# Altium schematic sheet PCB_control_swarm_robotics_schematic.SchDoc: Falda de sensores ultrasónicos
size Letter; Date: julio-2017; Author: William Abel Orozco Cifuentes; DrawnBy: William Abel Orozco Cifuentes; Organization: Universidad Del Valle De Guatemala; Curso: Proyecto 3 de electrónica
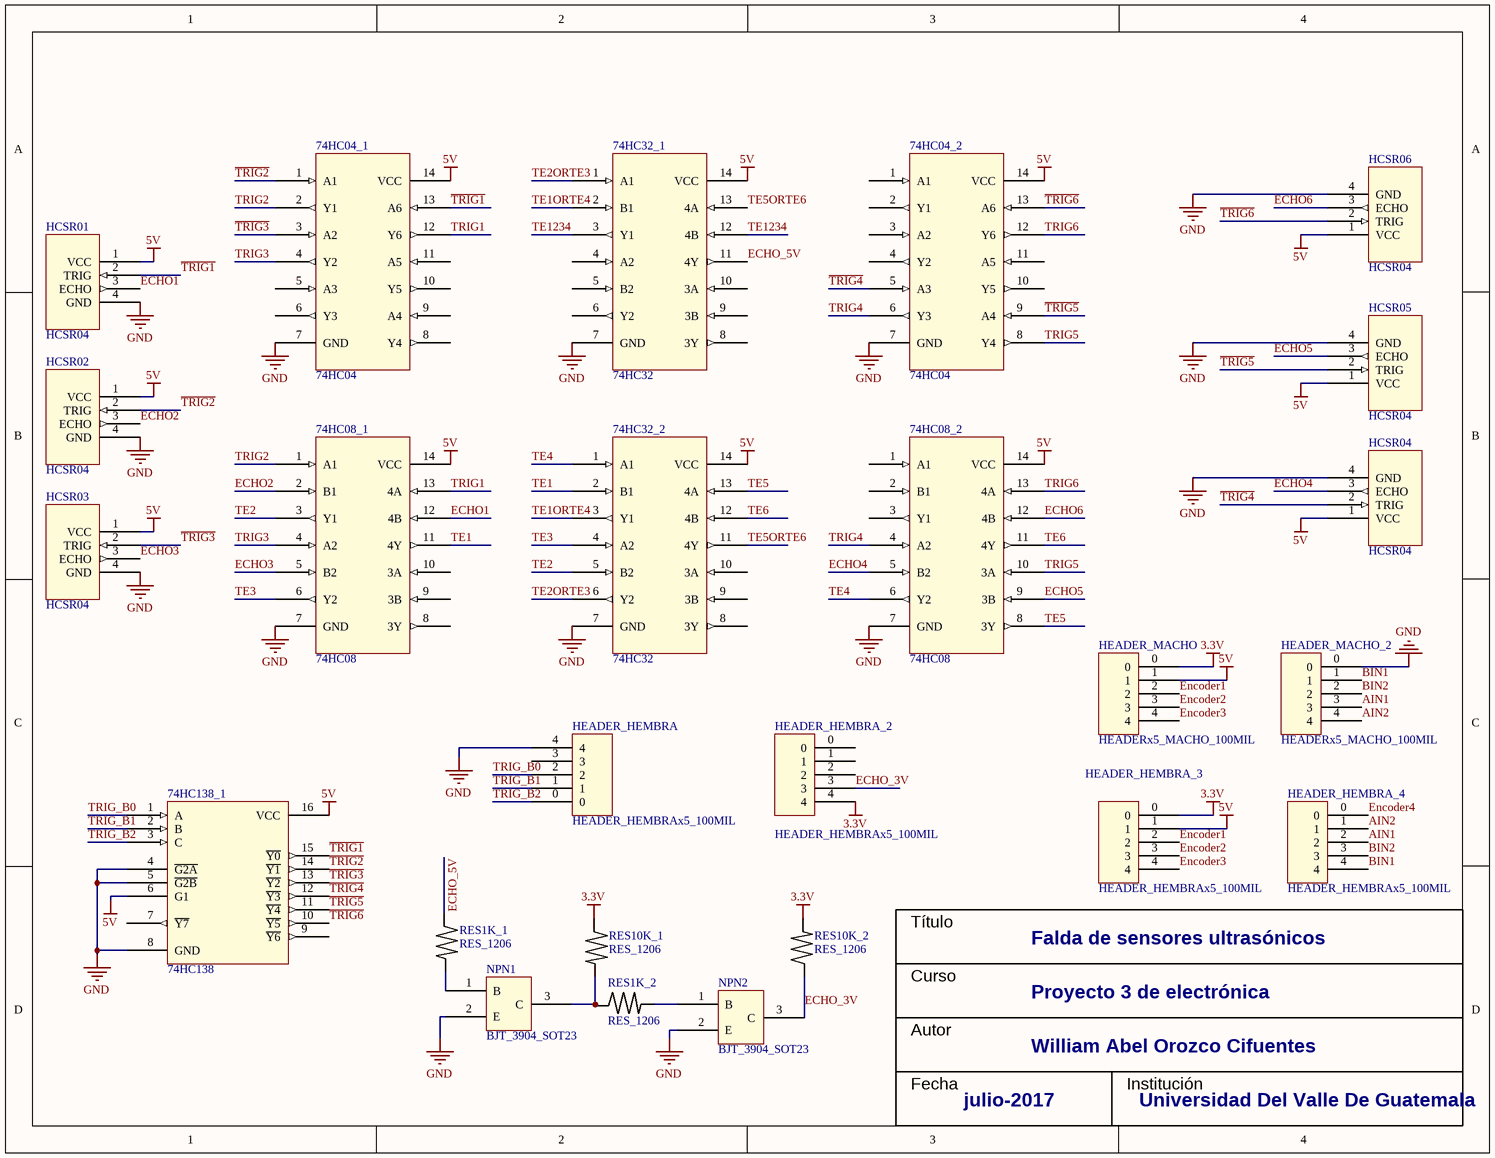
[diagram p0: PCB_control_swarm_robotics_schematic.SchDoc]

## Parts
74HC04_1  74HC04  [SOIC_14_D]
74HC04_2  74HC04  [SOIC_14_D]
74HC08_1  74HC08  [SOIC_14_D]
74HC08_2  74HC08  [SOIC_14_D]
74HC32_1  74HC32  [SOIC_14_D]
74HC32_2  74HC32  [SOIC_14_D]
74HC138_1  74HC138  [SOIC16_74HC138DR]
HCSR01  HCSR04  [HC_SR04_FOOTPRINT]
HCSR02  HCSR04  [HC_SR04_FOOTPRINT]
HCSR03  HCSR04  [HC_SR04_FOOTPRINT]
HCSR04  HCSR04  [HC_SR04_FOOTPRINT]
HCSR05  HCSR04  [HC_SR04_FOOTPRINT]
HCSR06  HCSR04  [HC_SR04_FOOTPRINT]
HEADER_HEMBRA  HEADER_HEMBRAx5_100MIL  [HDRx5HEMBRA_FOOTPRINT]
HEADER_HEMBRA_2  HEADER_HEMBRAx5_100MIL  [HDRx5HEMBRA_FOOTPRINT]
HEADER_HEMBRA_3  HEADER_HEMBRAx5_100MIL  [HDRx5HEMBRA_FOOTPRINT]
HEADER_HEMBRA_4  HEADER_HEMBRAx5_100MIL  [HDRx5HEMBRA_FOOTPRINT]
HEADER_MACHO  HEADERx5_MACHO_100MIL  [HEADERx5_MACHO_FOOTPRINT]
HEADER_MACHO_2  HEADERx5_MACHO_100MIL  [HEADERx5_MACHO_FOOTPRINT]
NPN1  BJT_3904_SOT23  [SOT23_3]
NPN2  BJT_3904_SOT23  [SOT23_3]
RES1K_1  RES_1206  [RES_SMD_1206]
RES1K_2  RES_1206  [RES_SMD_1206]
RES10K_1  RES_1206  [RES_SMD_1206]
RES10K_2  RES_1206  [RES_SMD_1206]

## Nets
3.3V: HEADER_HEMBRA_2.4 HEADER_HEMBRA_3.0 HEADER_MACHO.0 RES10K_1.1 RES10K_2.2
5V: 74HC04_1.14(VCC) 74HC04_2.14(VCC) 74HC08_1.14(VCC) 74HC08_2.14(VCC) 74HC32_1.14(VCC) 74HC32_2.14(VCC) 74HC138_1.6(G1) 74HC138_1.16(VCC) HCSR01.1(VCC) HCSR02.1(VCC) HCSR03.1(VCC) HCSR04.1(VCC) HCSR05.1(VCC) HCSR06.1(VCC) HEADER_HEMBRA_3.1 HEADER_MACHO.1
GND: 74HC04_1.7(GND) 74HC04_2.7(GND) 74HC08_1.7(GND) 74HC08_2.7(GND) 74HC32_1.7(GND) 74HC32_2.7(GND) 74HC138_1.4(~{G2A}) 74HC138_1.5(~{G2B}) 74HC138_1.8(GND) HCSR01.4(GND) HCSR02.4(GND) HCSR03.4(GND) HCSR04.4(GND) HCSR05.4(GND) HCSR06.4(GND) HEADER_HEMBRA.4 HEADER_MACHO_2.0 NPN1.2(E) NPN2.2(E)
AIN1: HEADER_HEMBRA_4.2 HEADER_MACHO_2.3
AIN2: HEADER_HEMBRA_4.1 HEADER_MACHO_2.4
BIN1: HEADER_HEMBRA_4.4 HEADER_MACHO_2.1
BIN2: HEADER_HEMBRA_4.3 HEADER_MACHO_2.2
ECHO1: 74HC08_1.12(4B) HCSR01.3(ECHO)
ECHO2: 74HC08_1.2(B1) HCSR02.3(ECHO)
ECHO3: 74HC08_1.5(B2) HCSR03.3(ECHO)
ECHO4: 74HC08_2.5(B2) HCSR04.3(ECHO)
ECHO5: 74HC08_2.9(3B) HCSR05.3(ECHO)
ECHO6: 74HC08_2.12(4B) HCSR06.3(ECHO)
ECHO_3V: HEADER_HEMBRA_2.3 NPN2.3(C) RES10K_2.1
ECHO_5V: 74HC32_1.11(4Y) RES1K_1.1
Encoder1: HEADER_HEMBRA_3.2 HEADER_MACHO.2
Encoder2: HEADER_HEMBRA_3.3 HEADER_MACHO.3
Encoder3: HEADER_HEMBRA_3.4 HEADER_MACHO.4
Encoder4: HEADER_HEMBRA_4.0
~{TRIG1}: 74HC04_1.13(A6) 74HC138_1.15(~{Y0}) HCSR01.2(TRIG)
~{TRIG2}: 74HC04_1.1(A1) 74HC138_1.14(~{Y1}) HCSR02.2(TRIG)
~{TRIG3}: 74HC04_1.3(A2) 74HC138_1.13(~{Y2}) HCSR03.2(TRIG)
~{TRIG4}: 74HC04_2.5(A3) 74HC138_1.12(~{Y3}) HCSR04.2(TRIG)
~{TRIG5}: 74HC04_2.9(A4) 74HC138_1.11(~{Y4}) HCSR05.2(TRIG)
~{TRIG6}: 74HC04_2.13(A6) 74HC138_1.10(~{Y5}) HCSR06.2(TRIG)
TE1: 74HC08_1.11(4Y) 74HC32_2.2(B1)
TE1ORTE4: 74HC32_1.2(B1) 74HC32_2.3(Y1)
TE2: 74HC08_1.3(Y1) 74HC32_2.5(B2)
TE2ORTE3: 74HC32_1.1(A1) 74HC32_2.6(Y2)
TE3: 74HC08_1.6(Y2) 74HC32_2.4(A2)
TE4: 74HC08_2.6(Y2) 74HC32_2.1(A1)
TE5: 74HC08_2.8(3Y) 74HC32_2.13(4A)
TE5ORTE6: 74HC32_1.13(4A) 74HC32_2.11(4Y)
TE6: 74HC08_2.11(4Y) 74HC32_2.12(4B)
TE1234: 74HC32_1.3(Y1) 74HC32_1.12(4B)
TRIG1: 74HC04_1.12(Y6) 74HC08_1.13(4A)
TRIG2: 74HC04_1.2(Y1) 74HC08_1.1(A1)
TRIG3: 74HC04_1.4(Y2) 74HC08_1.4(A2)
TRIG4: 74HC04_2.6(Y3) 74HC08_2.4(A2)
TRIG5: 74HC04_2.8(Y4) 74HC08_2.10(3A)
TRIG6: 74HC04_2.12(Y6) 74HC08_2.13(4A)
TRIG_B0: 74HC138_1.1(A) HEADER_HEMBRA.2
TRIG_B1: 74HC138_1.2(B) HEADER_HEMBRA.1
TRIG_B2: 74HC138_1.3(C) HEADER_HEMBRA.0
NetNPN1_1: NPN1.1(B) RES1K_1.2
NetNPN1_3: NPN1.3(C) RES1K_2.1 RES10K_1.2
NetNPN2_1: NPN2.1(B) RES1K_2.2

Not connected (* = marked no-connect by the designer): 74HC04_1 5(A3) 6(Y3) 8(Y4) 9(A4) 10(Y5) 11(A5); 74HC04_2 1(A1) 2(Y1) 3(A2) 4(Y2) 10(Y5) 11(A5); 74HC08_1 8(3Y) 9(3B) 10(3A); 74HC08_2 1(A1) 2(B1) 3(Y1); 74HC32_1 4(A2) 5(B2) 6(Y2) 8(3Y) 9(3B) 10(3A); 74HC32_2 8(3Y) 9(3B) 10(3A); 74HC138_1 7(~{Y7}) 9(~{Y6}); HEADER_HEMBRA 3; HEADER_HEMBRA_2 0 1 2

## Notes on the sheet
- Título
- Autor
- Curso
- Fecha
- Institución